# Altium schematic sheet Bitcoiner_EB_Project_V1I1_Schematic.SchDoc: Bitcoiner Expansion Board (part 1 of 3)
size A2; Author: Laura Regan; DocumentNumber: 1; Revision: 3; SheetNumber: 1; SheetTotal: 1
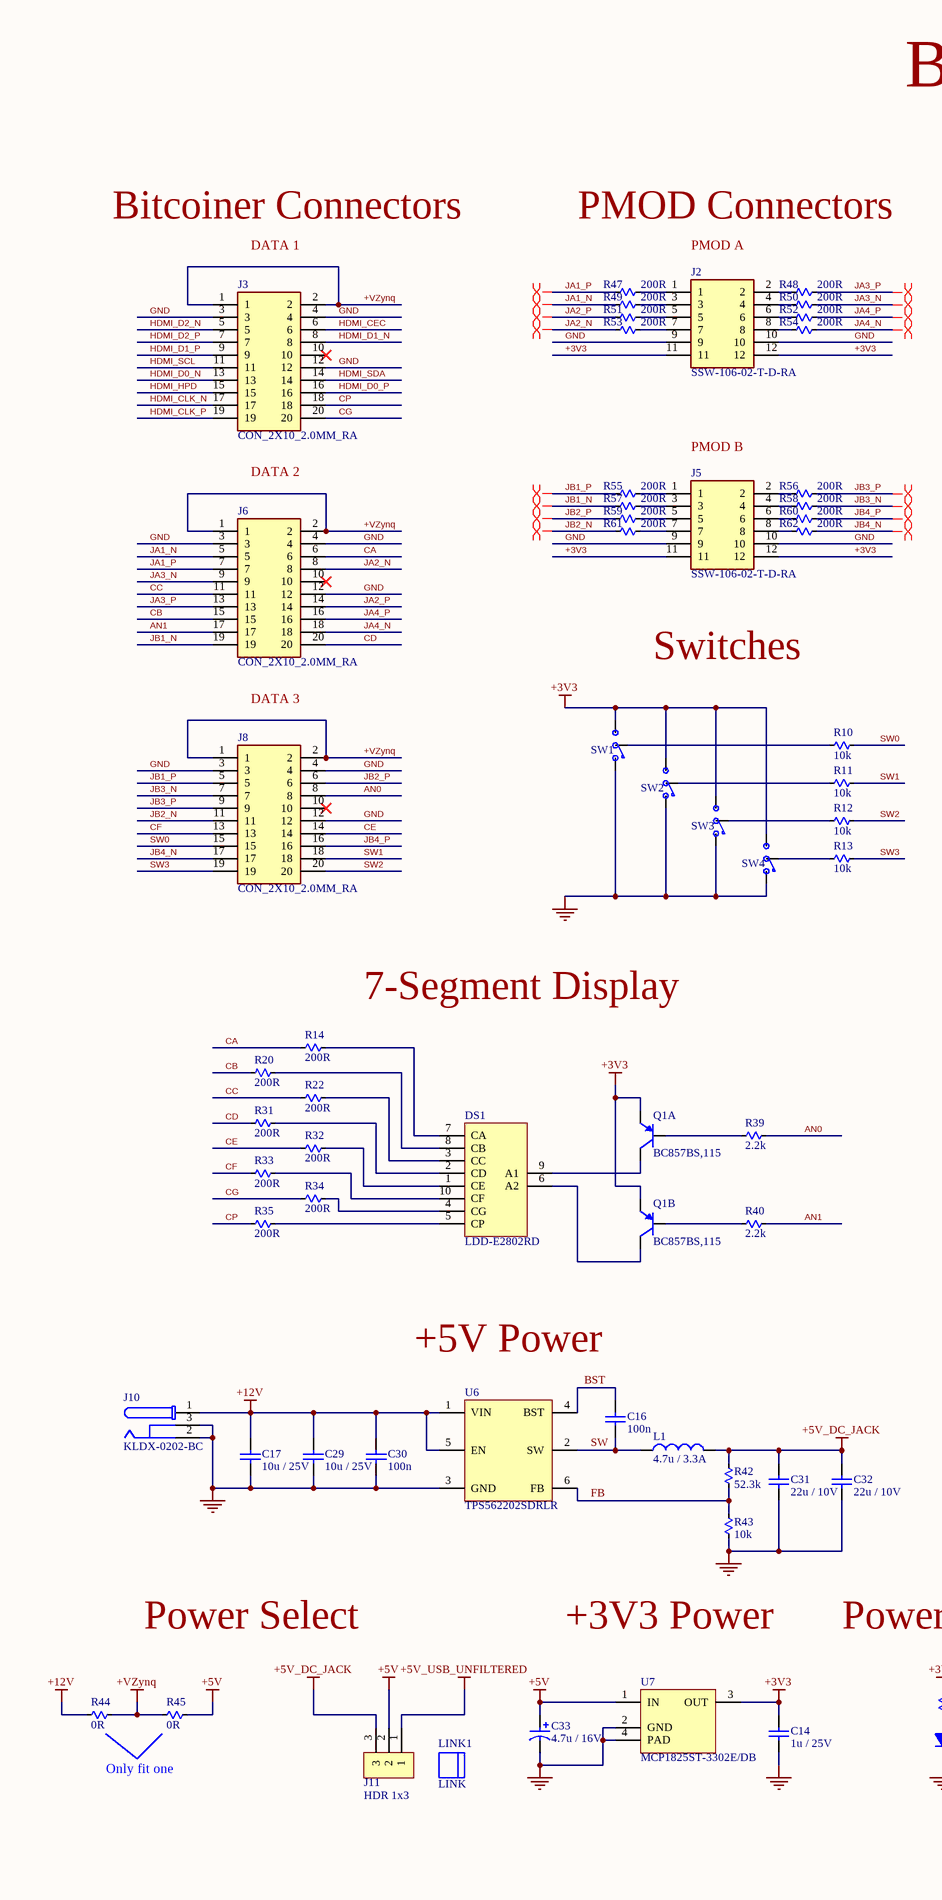
[diagram p0: Bitcoiner_EB_Project_V1I1_Schematic.SchDoc, left]
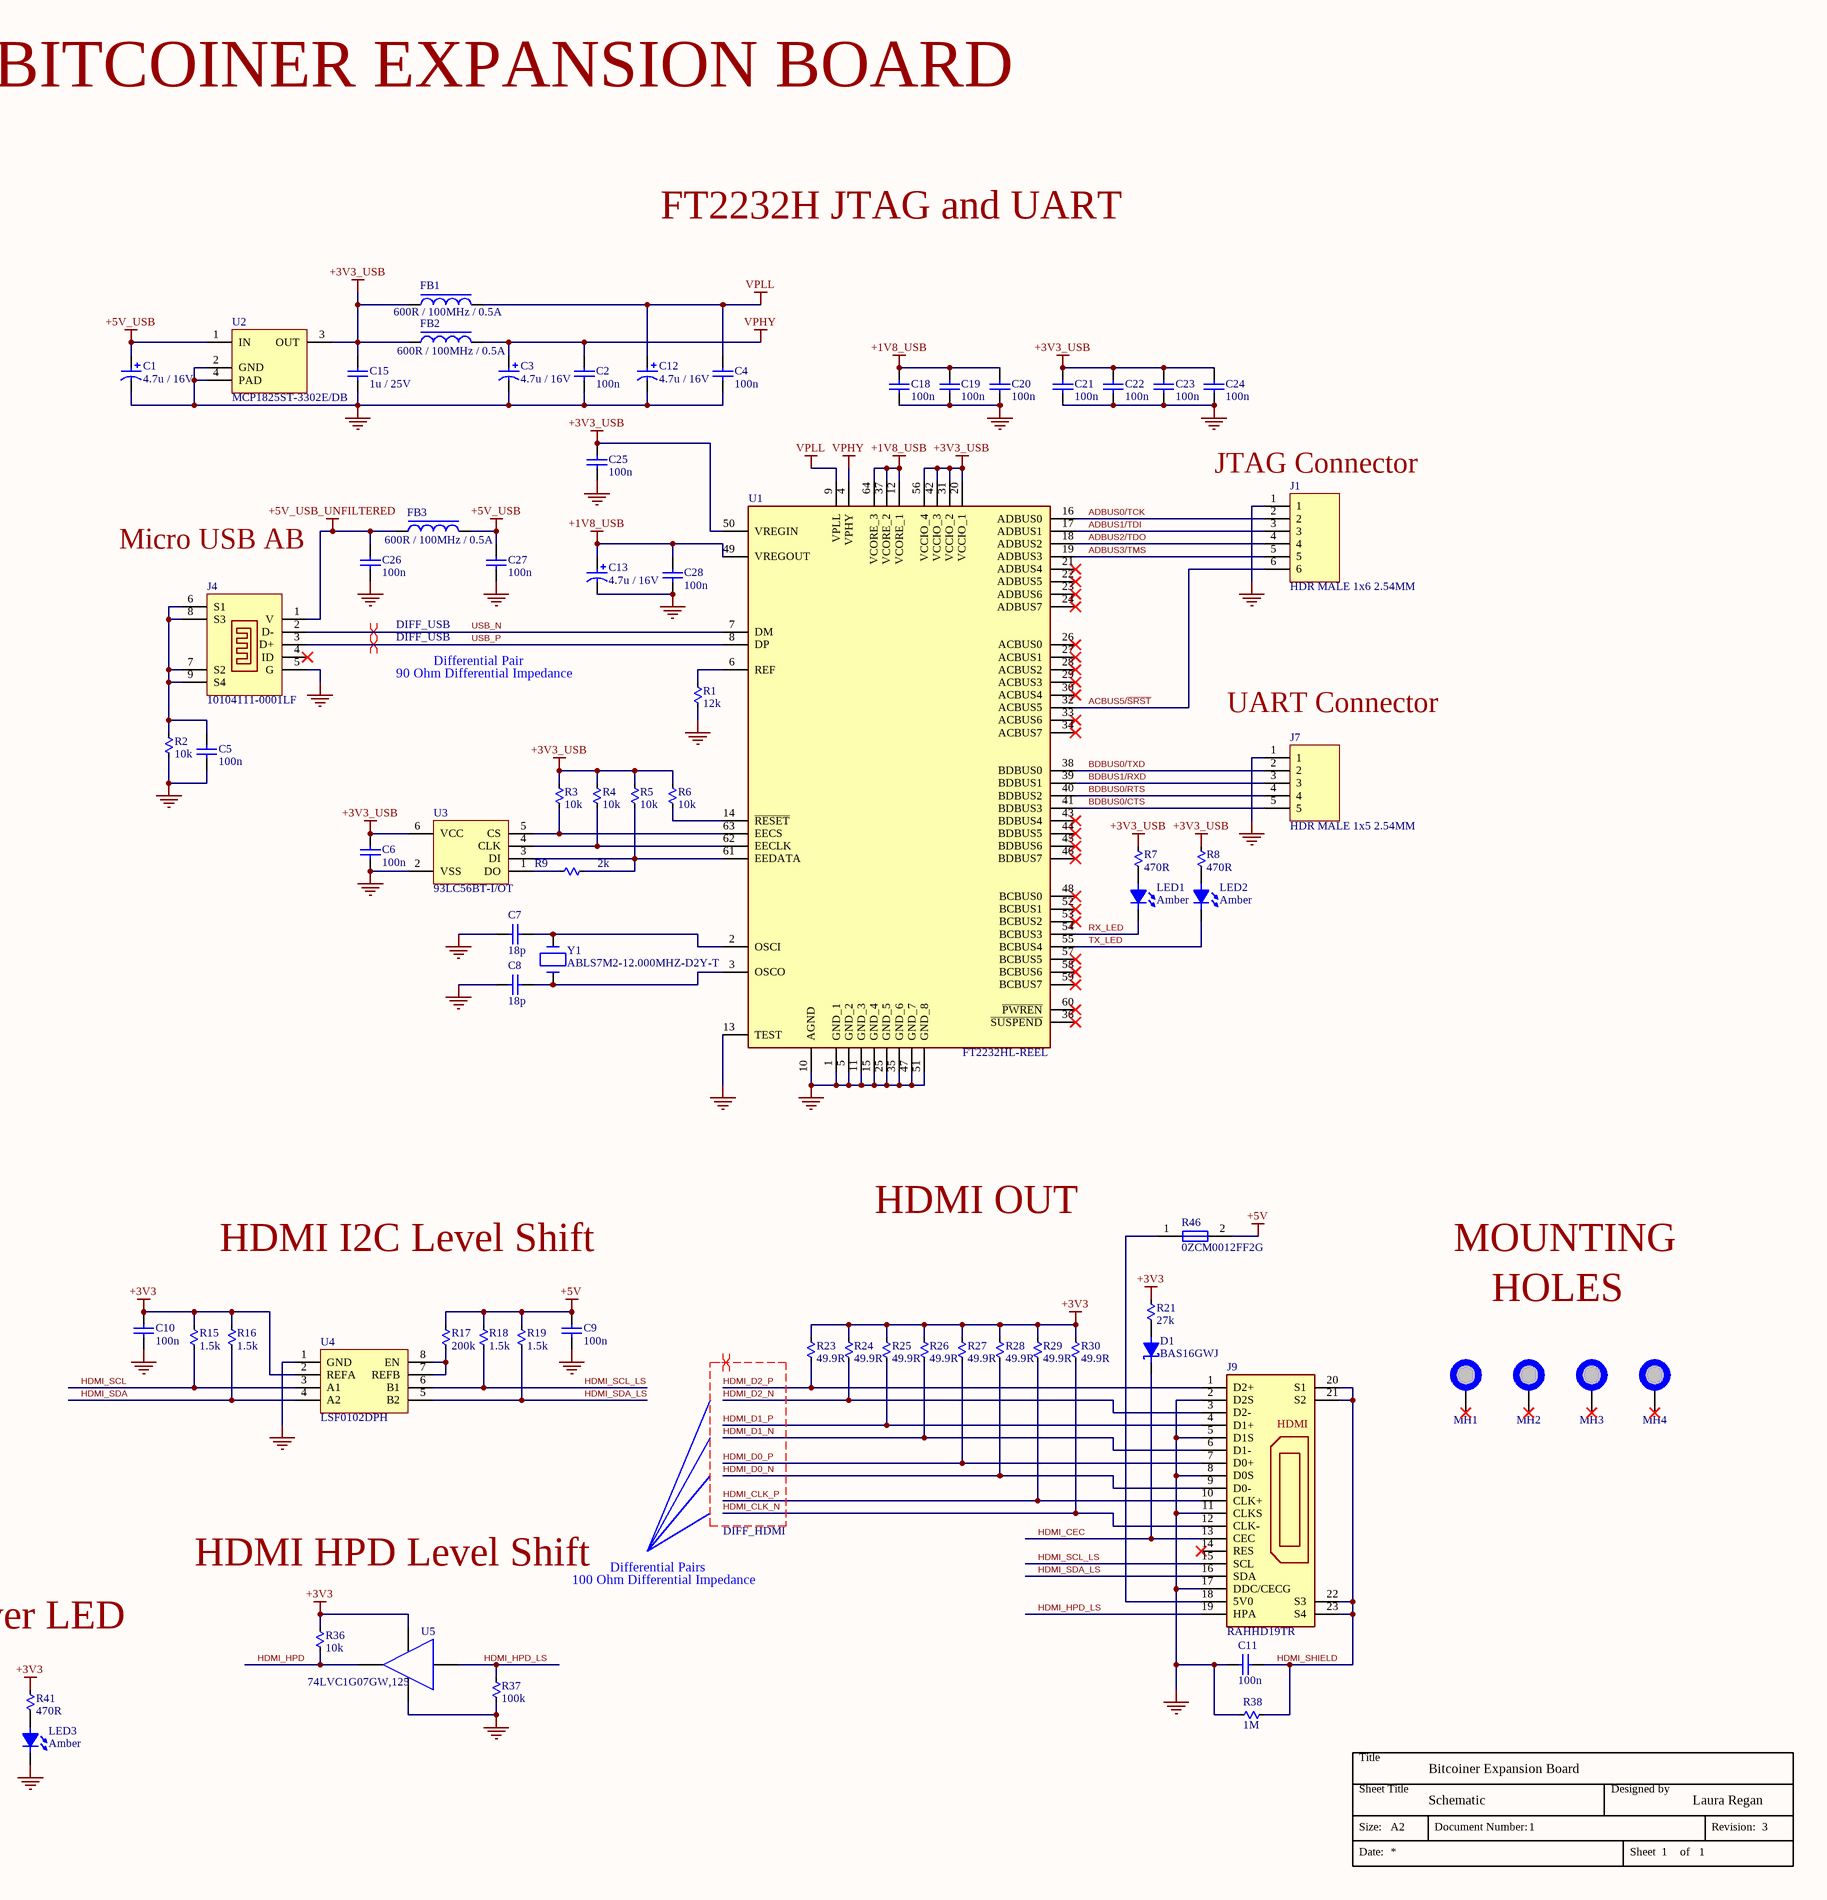
[diagram p1: Bitcoiner_EB_Project_V1I1_Schematic.SchDoc, right]

## Parts
*  Sheet Title: Schematic  Size: A2  (hidden comment: TitleBlock)  (graphical)
C1  4.7u / 16V  [C_TAN_A]
C2  100n  [C0805]
C3  4.7u / 16V  [C_TAN_A]
C4  100n  [C0805]
C5  100n  [C0805]
C6  100n  [C0805]
C7  18p  [C0805]
C8  18p  [C0805]
C9  100n  [C0805]
C10  100n  [C0805]
C11  100n  [C0805]
C12  4.7u / 16V  [C_TAN_A]
C13  4.7u / 16V  [C_TAN_A]
C14  1u / 25V  [C0805]
C15  1u / 25V  [C0805]
C16  100n  [C0805]
C17  10u / 25V  [C0805]
C18  100n  [C0805]
C19  100n  [C0805]
C20  100n  [C0805]
C21  100n  [C0805]
C22  100n  [C0805]
C23  100n  [C0805]
C24  100n  [C0805]
C25  100n  [C0805]
C26  100n  [C0805]
C27  100n  [C0805]
C28  100n  [C0805]
C29  10u / 25V  [C0805]
C30  100n  [C0805]
C31  22u / 10V  [C0805]
C32  22u / 10V  [C0805]
C33  4.7u / 16V  [C_TAN_A]
D1  BAS16GWJ  [SOD123]
DS1  LDD-E2802RD  [LDD-E2802RD]
FB1  600R / 100MHz / 0.5A  [R0805]
FB2  600R / 100MHz / 0.5A  [R0805]
FB3  600R / 100MHz / 0.5A  [R0805]
J1  HDR MALE 1x6 2.54MM  [HDR_MALE_1X6_2.54MM]
J2  SSW-106-02-T-D-RA  [SSW-106-XX-YYY-D-RA]
J3  CON_2X10_2.0MM_RA  [CON_2X10_2.0MM_RA]
J4  10104111-0001LF  [101041110001LF]
J5  SSW-106-02-T-D-RA  [SSW-106-XX-YYY-D-RA]
J6  CON_2X10_2.0MM_RA  [CON_2X10_2.0MM_RA]
J7  HDR MALE 1x5 2.54MM  [Hdr_Female_1x5_2.54mm]
J8  CON_2X10_2.0MM_RA  [CON_2X10_2.0MM_RA]
J9  RAHHD19TR  [RAHHD19TR]
J10  KLDX-0202-BC  [KLDX-0202-BC]
J11  HDR 1x3  [HDR_Male_1x3_2.54mm]
L1  4.7u / 3.3A  [TYS6045]
LED1  Amber  [LED0603]
LED2  Amber  [LED0603]
LED3  Amber  [LED0603]
LINK1  LINK  (mechanical)
MH1  MH_7.4MMNC_3.2MMD  [MH_7.4MMD_3.2MMD_NON_COPPER_NPTH]  (value not drawn)  (no BOM)
MH2  MH_7.4MMNC_3.2MMD  [MH_7.4MMD_3.2MMD_NON_COPPER_NPTH]  (value not drawn)  (no BOM)
MH3  MH_7.4MMNC_3.2MMD  [MH_7.4MMD_3.2MMD_NON_COPPER_NPTH]  (value not drawn)  (no BOM)
MH4  MH_7.4MMNC_3.2MMD  [MH_7.4MMD_3.2MMD_NON_COPPER_NPTH]  (value not drawn)  (no BOM)
Q1  BC857BS,115  [SOT363]  (parts A,B of 2)
R1  12k  [R0805]
R2  10k  [R0805]
R3  10k  [R0805]
R4  10k  [R0805]
R5  10k  [R0805]
R6  10k  [R0805]
R7  470R  [R0805]
R8  470R  [R0805]
R9  2k  [R0805]
R10  10k  [R0805]
R11  10k  [R0805]
R12  10k  [R0805]
R13  10k  [R0805]
R14  200R  [R0805]
R15  1.5k  [R0805]
R16  1.5k  [R0805]
R17  200k  [R0805]
R18  1.5k  [R0805]
R19  1.5k  [R0805]
R20  200R  [R0805]
R21  27k  [R0805]
R22  200R  [R0805]
R23  49.9R  [R0603]
R24  49.9R  [R0603]
R25  49.9R  [R0603]
R26  49.9R  [R0603]
R27  49.9R  [R0603]
R28  49.9R  [R0603]
R29  49.9R  [R0603]
R30  49.9R  [R0603]
R31  200R  [R0805]
R32  200R  [R0805]
R33  200R  [R0805]
R34  200R  [R0805]
R35  200R  [R0805]
R36  10k  [R0805]
R37  100k  [R0805]
R38  1M  [R0805]
R39  2.2k  [R0805]
R40  2.2k  [R0805]
R41  470R  [R0805]
R42  52.3k  [R0805]
R43  10k  [R0805]
R44  0R  [R0805]
R45  0R  [R0805]
R46  0ZCM0012FF2G  [0ZCM0012FF2G]
R47  200R  [R0603]
R48  200R  [R0603]
R49  200R  [R0603]
R50  200R  [R0603]
R51  200R  [R0603]
R52  200R  [R0603]
R53  200R  [R0603]
R54  200R  [R0603]
R55  200R  [R0603]
R56  200R  [R0603]
R57  200R  [R0603]
R58  200R  [R0603]
R59  200R  [R0603]
R60  200R  [R0603]
R61  200R  [R0603]
R62  200R  [R0603]
SW1  OS102011MS2QN1  [OS102011MS2QN1]  (value not drawn)
SW2  OS102011MS2QN1  [OS102011MS2QN1]  (value not drawn)
SW3  OS102011MS2QN1  [OS102011MS2QN1]  (value not drawn)
SW4  OS102011MS2QN1  [OS102011MS2QN1]  (value not drawn)
U1  FT2232HL-REEL  [QFP50P1200X1200X160-64N]
U2  MCP1825ST-3302E/DB  [SOT-223-3]
U3  93LC56BT-I/OT  [SOT-23-6]
U4  LSF0102DPH  [SOT505-2]
U5  74LVC1G07GW,125  [SOT353-1]
U6  TPS562202SDRLR  [SOT563-6]
U7  MCP1825ST-3302E/DB  [SOT-223-3]
Y1  ABLS7M2-12.000MHZ-D2Y-T  [ABLS7M2-12.000MHZ-D2Y-T]

## Nets
+1V8_USB: C13.1 C18.2 C19.2 C20.2 C28.2 U1.12(VCORE_1) U1.37(VCORE_2) U1.49(VREGOUT) U1.64(VCORE_3)
+3V3: C10.2 C14.2 J2.11 J2.12 J5.11 J5.12 Q1.1 Q1.4 R15.2 R16.2 R21.2 R23.2 R24.2 R25.2 R26.2 R27.2 R28.2 R29.2 R30.2 R36.2 R41.2 SW1.1 SW2.1 SW3.1 SW4.1 U4.2(REFA) U5.5 U7.3(OUT)
+3V3_USB: C6.2 C15.2 C21.2 C22.2 C23.2 C24.2 C25.2 FB1.1 FB2.1 R3.2 R4.2 R5.2 R6.2 R7.2 R8.2 U1.20(VCCIO_1) U1.31(VCCIO_2) U1.42(VCCIO_3) U1.50(VREGIN) U1.56(VCCIO_4) U2.3(OUT) U3.6(VCC)
+5V: C9.2 C33.1 J11.2 R17.2 R18.2 R19.2 R45.2 R46.2 U7.1(IN)
+5V_DC_JACK: C31.2 C32.2 J11.3 L1.2 R42.2
+5V_USB: C1.1 C27.2 FB3.2 U2.1(IN)
+5V_USB_UNFILTERED: C26.2 FB3.1 J4.1(V) J11.1
+12V: C17.2 C29.2 C30.2 J10.1 R44.1 U6.1(VIN) U6.5(EN)
+VZynq: J3.1 J3.2 J6.1 J6.2 J8.1 J8.2 R44.2 R45.1
GND: C1.2 C2.1 C3.2 C4.1 C5.1 C6.1 C7.1 C8.1 C9.1 C10.1 C11.1 C12.2 C13.2 C14.1 C15.1 C17.1 C18.1 C19.1 C20.1 C21.1 C22.1 C23.1 C24.1 C25.1 C26.1 C27.1 C28.1 C29.1 C30.1 C31.1 C32.1 C33.2 J1.1 J2.9 J2.10 J3.3 J3.4 J3.12 J4.5(G) J5.9 J5.10 J6.3 J6.4 J6.12 J7.1 J8.3 J8.4 J8.12 J9.2(D2S) J9.5(D1S) J9.8(D0S) J9.11(CLKS) J9.17(DDC/CECG) J10.2 J10.3 LED3.1(Cathode) R1.1 R2.1 R37.1 R38.1 R43.1 SW1.3 SW2.3 SW3.3 SW4.3 U1.1(GND_1) U1.5(GND_2) U1.10(AGND) U1.11(GND_3) U1.13(TEST) U1.15(GND_4) U1.25(GND_5) U1.35(GND_6) U1.47(GND_7) U1.51(GND_8) U2.2(GND) U2.4(PAD) U3.2(VSS) U4.1(GND) U5.3 U6.3(GND) U7.2(GND) U7.4(PAD)
VPHY: C2.2 C3.1 FB2.2 U1.4(VPHY)
VPLL: C4.2 C12.1 FB1.2 U1.9(VPLL)
ACBUS5/~{SRST}: J1.6 U1.32(ACBUS5)
ADBUS0/TCK: J1.2 U1.16(ADBUS0)
ADBUS1/TDI: J1.3 U1.17(ADBUS1)
ADBUS2/TDO: J1.4 U1.18(ADBUS2)
ADBUS3/TMS: J1.5 U1.19(ADBUS3)
AN0: J8.8 R39.2
AN1: J6.17 R40.2
BDBUS0/CTS: J7.5 U1.41(BDBUS3)
BDBUS0/RTS: J7.4 U1.40(BDBUS2)
BDBUS0/TXD: J7.2 U1.38(BDBUS0)
BDBUS1/RXD: J7.3 U1.39(BDBUS1)
BST: C16.2 U6.4(BST)
CA: J6.6 R14.1
CB: J6.15 R20.1
CC: J6.11 R22.1
CD: J6.20 R31.1
CE: J8.14 R32.1
CF: J8.13 R33.1
CG: J3.20 R34.1
CP: J3.18 R35.1
FB: R42.1 R43.2 U6.6(FB)
HDMI_CEC: D1.1(Cathode) J3.6 J9.13(CEC)
HDMI_CLK_N: J3.17 J9.12(CLK-) R30.1
HDMI_CLK_P: J3.19 J9.10(CLK+) R29.1
HDMI_D0_N: J3.13 J9.9(D0-) R28.1
HDMI_D0_P: J3.16 J9.7(D0+) R27.1
HDMI_D1_N: J3.8 J9.6(D1-) R26.1
HDMI_D1_P: J3.9 J9.4(D1+) R25.1
HDMI_D2_N: J3.5 J9.3(D2-) R24.1
HDMI_D2_P: J3.7 J9.1(D2+) R23.1
HDMI_HPD: J3.15 R36.1 U5.4
HDMI_HPD_LS: J9.19(HPA) R37.2 U5.2
HDMI_SCL: J3.11 R15.1 U4.3(A1)
HDMI_SCL_LS: J9.15(SCL) R18.1 U4.6(B1)
HDMI_SDA: J3.14 R16.1 U4.4(A2)
HDMI_SDA_LS: J9.16(SDA) R19.1 U4.5(B2)
HDMI_SHIELD: C11.2 J9.20(S1) J9.21(S2) J9.22(S3) J9.23(S4) R38.2
JA1_N: J6.5 R49.1
JA1_P: J6.7 R47.1
JA2_N: J6.8 R53.1
JA2_P: J6.14 R51.1
JA3_N: J6.9 R50.2
JA3_P: J6.13 R48.2
JA4_N: J6.18 R54.2
JA4_P: J6.16 R52.2
JB1_N: J6.19 R57.1
JB1_P: J8.5 R55.1
JB2_N: J8.11 R61.1
JB2_P: J8.6 R59.1
JB3_N: J8.7 R58.2
JB3_P: J8.9 R56.2
JB4_N: J8.17 R62.2
JB4_P: J8.16 R60.2
RX_LED: LED1.1(Cathode) U1.54(BCBUS3)
SW: C16.1 L1.1 U6.2(SW)
SW0: J8.15 R10.2
SW1: J8.18 R11.2
SW2: J8.20 R12.2
SW3: J8.19 R13.2
TX_LED: LED2.1(Cathode) U1.55(BCBUS4)
USB_N: J4.2(D-) U1.7(DM)
USB_P: J4.3(D+) U1.8(DP)
NetC5_2: C5.2 J4.6(S1) J4.7(S2) J4.8(S3) J4.9(S4) R2.2
NetC7_2: C7.2 U1.2(OSCI) Y1.2
NetC8_2: C8.2 U1.3(OSCO) Y1.1
NetD1_2: D1.2(Anode) R21.1
NetDS1_1: DS1.1(CE) R32.2
NetDS1_2: DS1.2(CD) R31.2
NetDS1_3: DS1.3(CC) R22.2
NetDS1_4: DS1.4(CG) R34.2
NetDS1_5: DS1.5(CP) R35.2
NetDS1_6: DS1.6(A2) Q1.3
NetDS1_7: DS1.7(CA) R14.2
NetDS1_8: DS1.8(CB) R20.2
NetDS1_9: DS1.9(A1) Q1.6
NetDS1_10: DS1.10(CF) R33.2
NetJ2_1: J2.1 R47.2
NetJ2_2: J2.2 R48.1
NetJ2_3: J2.3 R49.2
NetJ2_4: J2.4 R50.1
NetJ2_5: J2.5 R51.2
NetJ2_6: J2.6 R52.1
NetJ2_7: J2.7 R53.2
NetJ2_8: J2.8 R54.1
NetJ5_1: J5.1 R55.2
NetJ5_2: J5.2 R56.1
NetJ5_3: J5.3 R57.2
NetJ5_4: J5.4 R58.1
NetJ5_5: J5.5 R59.2
NetJ5_6: J5.6 R60.1
NetJ5_7: J5.7 R61.2
NetJ5_8: J5.8 R62.1
NetJ9_18: J9.18(5V0) R46.1
NetLED1_2: LED1.2(Anode) R7.1
NetLED2_2: LED2.2(Anode) R8.1
NetLED3_2: LED3.2(Anode) R41.1
NetQ1_2: Q1.2 R39.1
NetQ1_5: Q1.5 R40.1
NetR1_2: R1.2 U1.6(REF)
NetR3_1: R3.1 U1.63(EECS) U3.5(CS)
NetR4_1: R4.1 U1.62(EECLK) U3.4(CLK)
NetR5_1: R5.1 R9.2 U1.61(EEDATA) U3.3(DI)
NetR6_1: R6.1 U1.14(~{RESET})
NetR9_1: R9.1 U3.1(DO)
NetR10_1: R10.1 SW1.2
NetR11_1: R11.1 SW2.2
NetR12_1: R12.1 SW3.2
NetR13_1: R13.1 SW4.2
NetR17_1: R17.1 U4.7(REFB) U4.8(EN)

Not connected (* = marked no-connect by the designer): J3 10*; J4 4(ID)*; J6 10*; J8 10*; J9 14(RES)*; MH1 1*; MH2 1*; MH3 1*; MH4 1*; U1 21(ADBUS4)* 22(ADBUS5)* 23(ADBUS6)* 24(ADBUS7)* 26(ACBUS0)* 27(ACBUS1)* 28(ACBUS2)* 29(ACBUS3)* 30(ACBUS4)* 33(ACBUS6)* 34(ACBUS7)* 36(~{SUSPEND})* 43(BDBUS4)* 44(BDBUS5)* 45(BDBUS6)* 46(BDBUS7)* 48(BCBUS0)* 52(BCBUS1)* 53(BCBUS2)* 57(BCBUS5)* 58(BCBUS6)* 59(BCBUS7)* 60(~{PWREN})*

## Layout directives
differential pair: JA1_N, JA1_P, JA2_N, JA2_P, JA3_N, JA3_P, JA4_N, JA4_P, JB1_N, JB1_P, JB2_N, JB2_P, JB3_N, JB3_P, JB4_N, JB4_P
differential pair; differential pair class DIFF_USB: USB_N, USB_P
differential pair; differential pair class DIFF_HDMI: HDMI_CLK_N, HDMI_CLK_P, HDMI_D0_N, HDMI_D0_P, HDMI_D1_N, HDMI_D1_P, HDMI_D2_N, HDMI_D2_P

## Notes on the sheet
- BITCOINER EXPANSION BOARD
- Bitcoiner Connectors
- PMOD Connectors
- FT2232H JTAG and UART
- DATA 1
- (near J2) PMOD A
- DATA 2
- (near J5) PMOD B
- (near J1) JTAG Connector
- Micro USB AB
- Switches
- Differential Pair
- DATA 3
- 90 Ohm Differential Impedance
- (near J7) UART Connector
- 7-Segment Display
- HDMI OUT
- HDMI I2C Level Shift
- MOUNTING
- +5V Power
- HOLES
- HDMI HPD Level Shift
- 100 Ohm Differential Impedance
- Differential Pairs
- Power Select
- +3V3 Power
- Power LED
- Only fit one
- (in symbol RAHHD19TR) HDMI
- (in symbol TitleBlock) Title; Sheet Title; Designed by; Size:; Document Number:; Revision:; Date:; Sheet; of